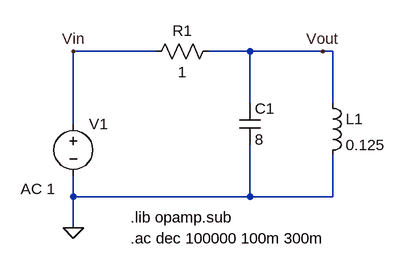
[diagram p0: schematic TS6.asc]
TS6.asc, the LTspice schematic file:
Version 4
SHEET 1 1244 680
WIRE -576 -48 -704 -48
WIRE -432 -48 -496 -48
WIRE -320 -48 -432 -48
WIRE -304 -48 -320 -48
WIRE -432 32 -432 -48
WIRE -304 32 -304 -48
WIRE -704 64 -704 -48
WIRE -704 176 -704 144
WIRE -432 176 -432 96
WIRE -432 176 -704 176
WIRE -304 176 -304 112
WIRE -304 176 -432 176
WIRE -704 224 -704 176
FLAG -704 224 0
FLAG -704 -48 Vin
FLAG -320 -48 Vout
SYMBOL voltage -704 48 R0
WINDOW 123 -81 116 Left 2
WINDOW 39 0 0 Left 0
SYMATTR Value2 AC 1
SYMATTR InstName V1
SYMATTR Value ""
SYMBOL res -480 -64 R90
WINDOW 0 0 56 VBottom 2
WINDOW 3 32 56 VTop 2
SYMATTR InstName R1
SYMATTR Value 1
SYMBOL cap -448 32 R0
SYMATTR InstName C1
SYMATTR Value 8
SYMBOL ind -320 16 R0
SYMATTR InstName L1
SYMATTR Value 0.125
TEXT -616 240 Left 2 !.ac dec 100000 100m 300m
TEXT -616 208 Left 2 !.lib opamp.sub

The netlist it stands for:
* TS6.asc
V1 Vin 0 AC 1
R1 Vout Vin 1
C1 Vout 0 8
L1 Vout 0 0.125
.ac dec 100000 100m 300m
.lib opamp.sub
.backanno
.end